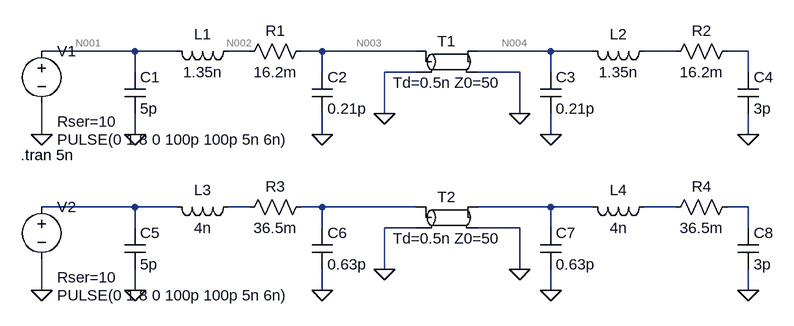
[diagram p0: schematic Draft1.asc]
Draft1.asc, the LTspice schematic file:
Version 4.1
SHEET 1 1160 680
WIRE 176 128 32 128
WIRE 240 128 176 128
WIRE 352 128 320 128
WIRE 464 128 432 128
WIRE 608 128 464 128
WIRE 816 128 704 128
WIRE 880 128 816 128
WIRE 1008 128 960 128
WIRE 1120 128 1088 128
WIRE 176 160 176 128
WIRE 464 160 464 128
WIRE 608 160 560 160
WIRE 768 160 704 160
WIRE 816 160 816 128
WIRE 1120 160 1120 128
WIRE 560 224 560 160
WIRE 768 224 768 160
WIRE 32 256 32 208
WIRE 176 256 176 224
WIRE 464 256 464 224
WIRE 816 256 816 224
WIRE 1120 256 1120 224
WIRE 176 368 32 368
WIRE 240 368 176 368
WIRE 352 368 320 368
WIRE 464 368 432 368
WIRE 608 368 464 368
WIRE 816 368 704 368
WIRE 880 368 816 368
WIRE 1008 368 960 368
WIRE 1120 368 1088 368
WIRE 176 400 176 368
WIRE 464 400 464 368
WIRE 608 400 560 400
WIRE 768 400 704 400
WIRE 816 400 816 368
WIRE 1120 400 1120 368
WIRE 560 464 560 400
WIRE 768 464 768 400
WIRE 32 496 32 448
WIRE 176 496 176 464
WIRE 464 496 464 464
WIRE 816 496 816 464
WIRE 1120 496 1120 464
FLAG 32 256 0
FLAG 176 256 0
FLAG 464 256 0
FLAG 816 256 0
FLAG 560 224 0
FLAG 768 224 0
FLAG 1120 256 0
FLAG 32 496 0
FLAG 176 496 0
FLAG 464 496 0
FLAG 816 496 0
FLAG 560 464 0
FLAG 768 464 0
FLAG 1120 496 0
SYMBOL voltage 32 112 R0
WINDOW 3 24 152 Left 2
WINDOW 123 0 0 Left 0
WINDOW 39 24 124 Left 2
SYMATTR InstName V1
SYMATTR Value PULSE(0 1.8 0 100p 100p 5n 6n)
SYMATTR SpiceLine Rser=10
SYMBOL cap 160 160 R0
SYMATTR InstName C1
SYMATTR Value 5p
SYMBOL ind 336 112 R90
WINDOW 0 5 56 VBottom 2
WINDOW 3 32 56 VTop 2
SYMATTR InstName L1
SYMATTR Value 1.35n
SYMATTR SpiceLine Rser=1m
SYMBOL res 448 112 R90
WINDOW 0 0 56 VBottom 2
WINDOW 3 32 56 VTop 2
SYMATTR InstName R1
SYMATTR Value 16.2m
SYMBOL cap 448 160 R0
SYMATTR InstName C2
SYMATTR Value 0.21p
SYMBOL tline 656 144 R0
SYMATTR InstName T1
SYMATTR Value Td=0.5n Z0=50
SYMBOL cap 800 160 R0
SYMATTR InstName C3
SYMATTR Value 0.21p
SYMBOL ind 976 112 R90
WINDOW 0 5 56 VBottom 2
WINDOW 3 32 56 VTop 2
SYMATTR InstName L2
SYMATTR Value 1.35n
SYMATTR SpiceLine Rser=1m
SYMBOL res 1104 112 R90
WINDOW 0 0 56 VBottom 2
WINDOW 3 32 56 VTop 2
SYMATTR InstName R2
SYMATTR Value 16.2m
SYMBOL cap 1104 160 R0
SYMATTR InstName C4
SYMATTR Value 3p
SYMBOL voltage 32 352 R0
WINDOW 3 24 152 Left 2
WINDOW 123 0 0 Left 0
WINDOW 39 24 124 Left 2
SYMATTR InstName V2
SYMATTR Value PULSE(0 1.8 0 100p 100p 5n 6n)
SYMATTR SpiceLine Rser=10
SYMBOL cap 160 400 R0
SYMATTR InstName C5
SYMATTR Value 5p
SYMBOL ind 336 352 R90
WINDOW 0 5 56 VBottom 2
WINDOW 3 32 56 VTop 2
SYMATTR InstName L3
SYMATTR Value 4n
SYMATTR SpiceLine Rser=1m
SYMBOL res 448 352 R90
WINDOW 0 0 56 VBottom 2
WINDOW 3 32 56 VTop 2
SYMATTR InstName R3
SYMATTR Value 36.5m
SYMBOL cap 448 400 R0
SYMATTR InstName C6
SYMATTR Value 0.63p
SYMBOL tline 656 384 R0
SYMATTR InstName T2
SYMATTR Value Td=0.5n Z0=50
SYMBOL cap 800 400 R0
SYMATTR InstName C7
SYMATTR Value 0.63p
SYMBOL ind 976 352 R90
WINDOW 0 5 56 VBottom 2
WINDOW 3 32 56 VTop 2
SYMATTR InstName L4
SYMATTR Value 4n
SYMATTR SpiceLine Rser=1m
SYMBOL res 1104 352 R90
WINDOW 0 0 56 VBottom 2
WINDOW 3 32 56 VTop 2
SYMATTR InstName R4
SYMATTR Value 36.5m
SYMBOL cap 1104 400 R0
SYMATTR InstName C8
SYMATTR Value 3p
TEXT 0 288 Left 2 !.tran 5n

The netlist it stands for:
* Draft1.asc
V1 N001 0 PULSE(0 1.8 0 100p 100p 5n 6n) Rser=10
C1 N001 0 5p
L1 N002 N001 1.35n Rser=1m
R1 N003 N002 16.2m
C2 N003 0 0.21p
T1 N003 0 N004 0 Td=0.5n Z0=50
C3 N004 0 0.21p
L2 N005 N004 1.35n Rser=1m
R2 N006 N005 16.2m
C4 N006 0 3p
V2 N007 0 PULSE(0 1.8 0 100p 100p 5n 6n) Rser=10
C5 N007 0 5p
L3 N008 N007 4n Rser=1m
R3 N009 N008 36.5m
C6 N009 0 0.63p
T2 N009 0 N010 0 Td=0.5n Z0=50
C7 N010 0 0.63p
L4 N011 N010 4n Rser=1m
R4 N012 N011 36.5m
C8 N012 0 3p
.tran 5n
.backanno
.end

* Results of the author's LTspice run, read from the files saved beside the schematic
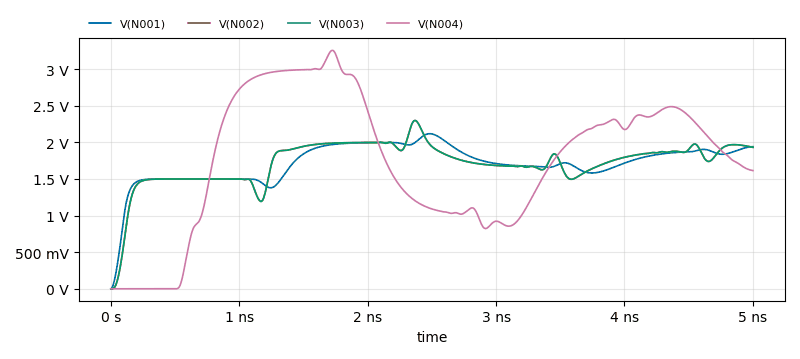
[diagram p1: Transient Analysis of Draft1.asc, plotted from the saved traces]
* Transient Analysis, 1 run:
*   V(N001): min 0 V, max 2.119 V, average 1.715 V, rms 1.738 V, last 1.943 V
*   V(N002): min 0 V, max 2.299 V, average 1.719 V, rms 1.748 V, last 1.933 V
*   V(N003): min 0 V, max 2.299 V, average 1.719 V, rms 1.748 V, last 1.933 V
*   V(N004): min 0 V, max 3.257 V, average 1.756 V, rms 1.988 V, last 1.615 V